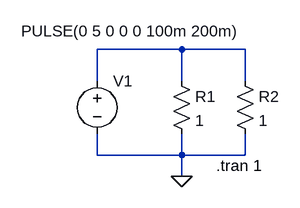
[diagram p0: schematic use .tran func..asc]
use .tran func..asc, the LTspice schematic file:
Version 4
SHEET 1 880 680
WIRE -96 -80 -224 -80
WIRE 0 -80 -96 -80
WIRE -224 -32 -224 -80
WIRE -96 -32 -96 -80
WIRE 0 -32 0 -80
WIRE -224 80 -224 48
WIRE -96 80 -96 48
WIRE -96 80 -224 80
WIRE 0 80 0 48
WIRE 0 80 -96 80
WIRE -96 112 -96 80
FLAG -96 112 0
SYMBOL voltage -224 -48 R0
WINDOW 3 -115 -59 Left 2
WINDOW 123 0 0 Left 0
WINDOW 39 0 0 Left 0
SYMATTR InstName V1
SYMATTR Value PULSE(0 5 0 0 0 100m 200m)
SYMBOL res -112 -48 R0
SYMATTR InstName R1
SYMATTR Value 1
SYMBOL res -16 -48 R0
SYMATTR InstName R2
SYMATTR Value 1
TEXT -44 96 Left 2 !.tran 1

The netlist it stands for:
* use .tran func..asc
V1 N001 0 PULSE(0 5 0 0 0 100m 200m)
R1 N001 0 1
R2 N001 0 1
.tran 1
.backanno
.end